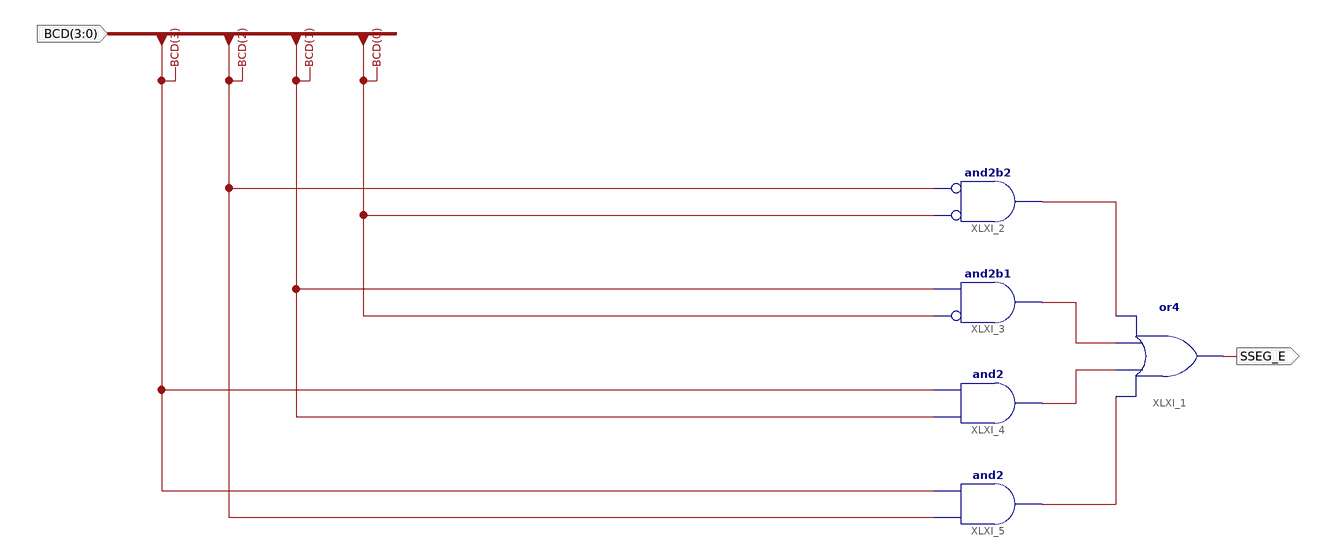
[diagram p0: schematic sheet 1]
// Xilinx ISE schematic SSEG_E.sch (spartan6) as structural Verilog: 5 symbols, 2 ports
module SSEG_E (
  input  [3:0] BCD,
  output SSEG_E
);

  wire XLXN_15, XLXN_17, XLXN_18, XLXN_19;

  and XLXI_2 (XLXN_15, ~BCD[0], ~BCD[2]);  // and2b2
  and XLXI_3 (XLXN_19, ~BCD[0], BCD[1]);  // and2b1
  and XLXI_4 (XLXN_17, BCD[1], BCD[3]);
  and XLXI_5 (XLXN_18, BCD[2], BCD[3]);
  or XLXI_1 (SSEG_E, XLXN_18, XLXN_17, XLXN_19, XLXN_15);
endmodule
